# Altium project PowerBoard.PrjPcb
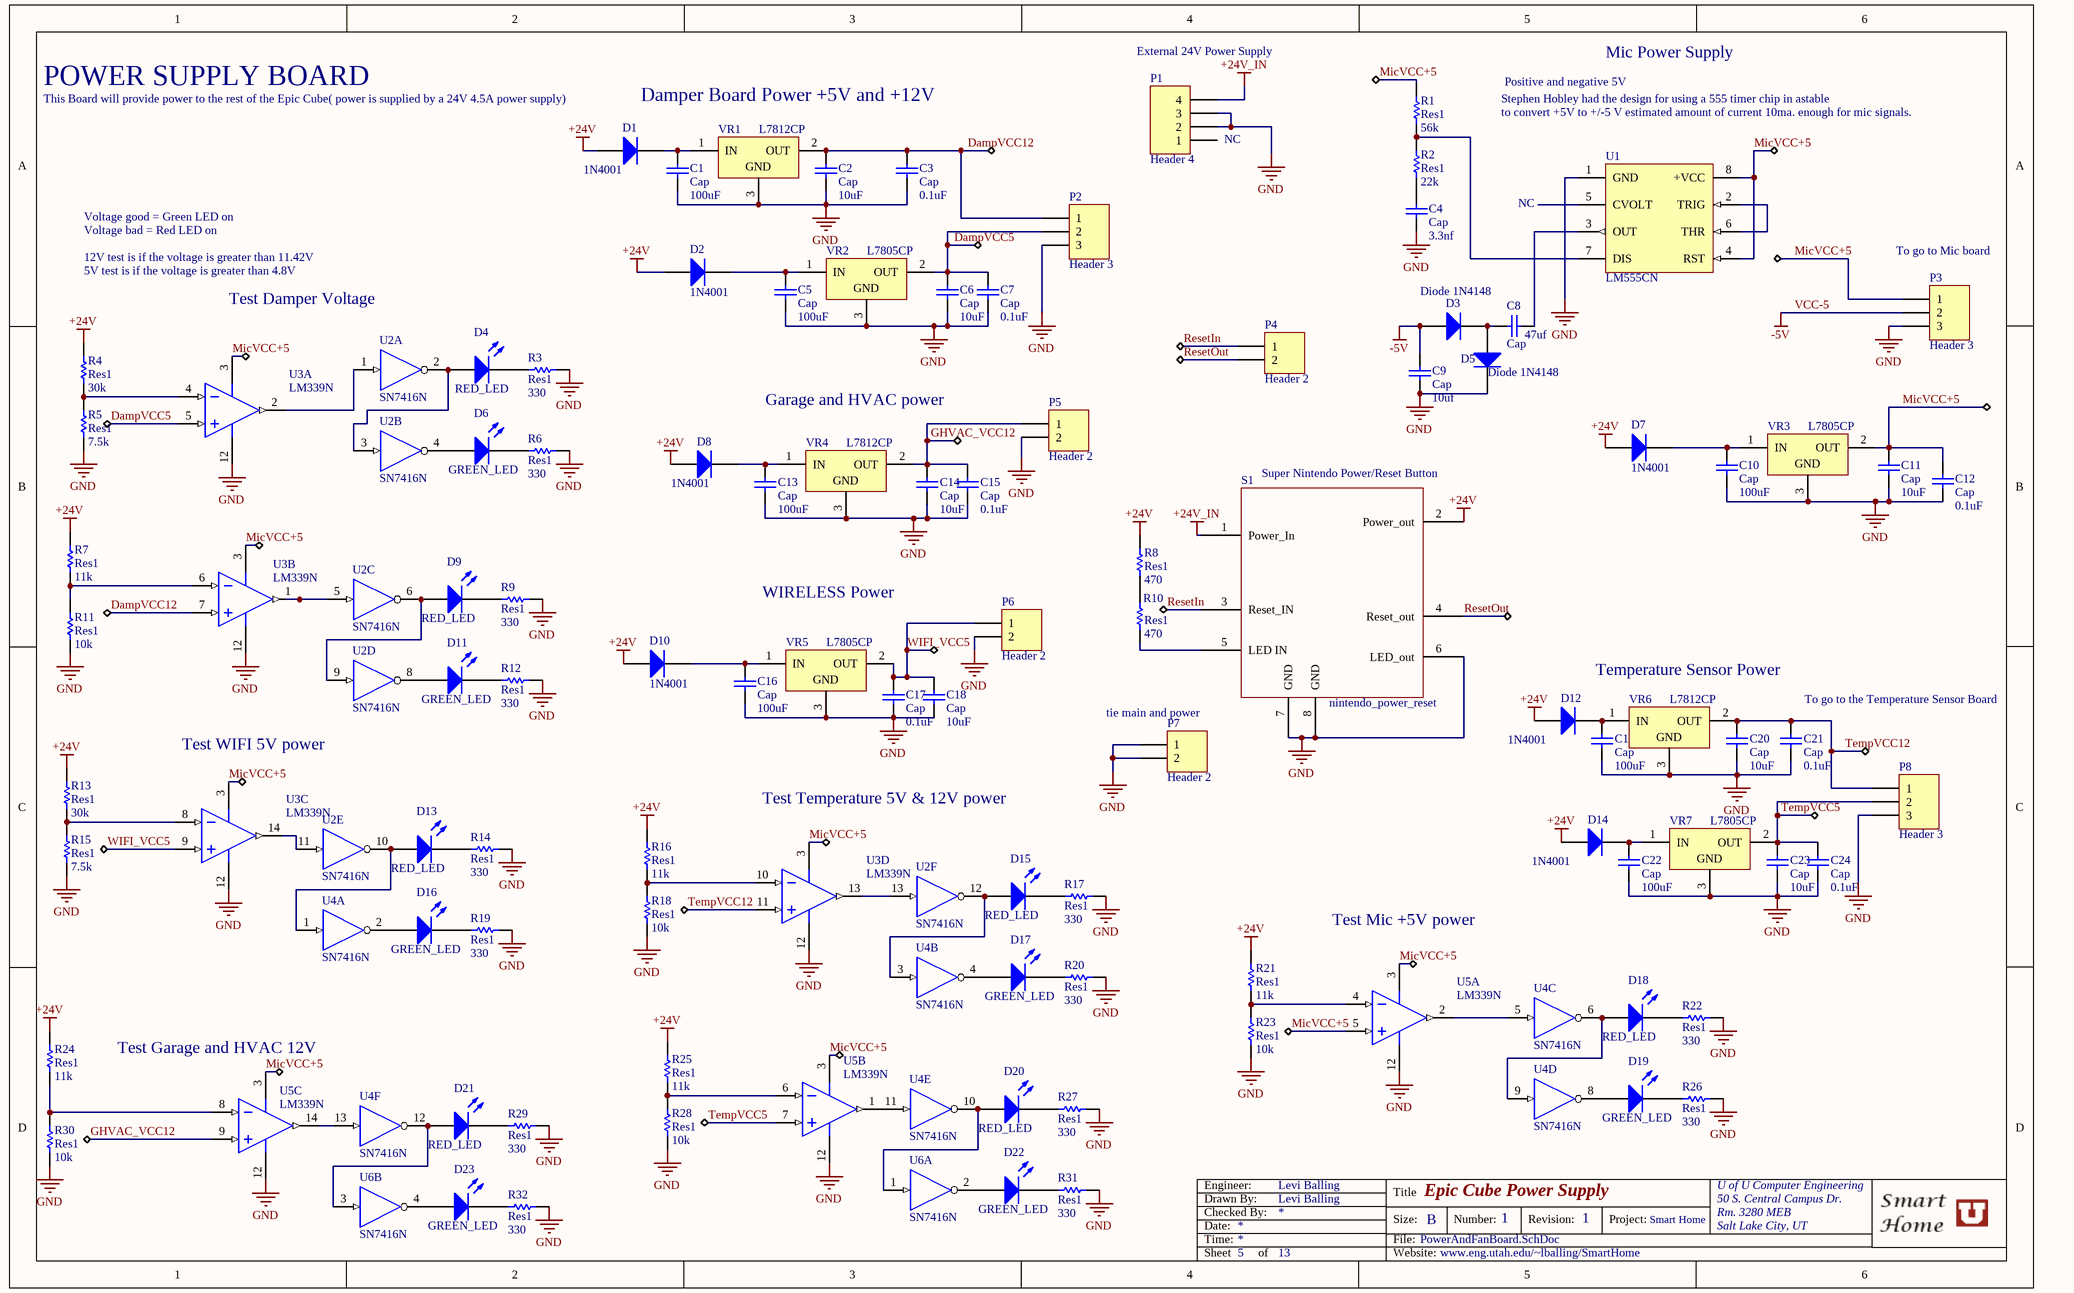
[diagram p0: PowerAndFanBoard.SchDoc]
1 sheet, 101 parts. Net scope: global (net labels, ports and power ports of the same name join across sheets).
Board file: PowerBoard.PcbDoc

## Sheet PowerAndFanBoard.SchDoc: Epic Cube Power Supply
size B; DrawnBy: Levi Balling; Engineer: Levi Balling; Organization: U of U Computer Engineering; Address1: 50 S. Central Campus Dr.; Address2: Rm. 3280 MEB; Address3: Salt Lake City, UT; Address4: Australia 2086; DocumentNumber: 1; Revision: 1; SheetNumber: 5; SheetTotal: 13; Website: www.eng.utah.edu/~lballing/SmartHome; Project: Smart Home; Description: This Board will provide power to the rest of the Epic Cube( power is supplied by a 24V 4.5A power supply); ProjectName: Smart Home

### Parts
C1  Cap  value 100uF  [RAD-0.3]
C2  Cap  value 10uF  [RAD-0.3]
C3  Cap  value 0.1uF  [RAD-0.3]
C4  Cap  value 3.3nf  [RAD-0.3]
C5  Cap  value 100uF  [RAD-0.3]
C6  Cap  value 10uF  [RAD-0.3]
C7  Cap  value 0.1uF  [RAD-0.3]
C8  Cap  value 47uf  [RAD-0.3]
C9  Cap  value 10uf  [RAD-0.3]
C10  Cap  value 100uF  [RAD-0.3]
C11  Cap  value 10uF  [RAD-0.3]
C12  Cap  value 0.1uF  [RAD-0.3]
C13  Cap  value 100uF  [RAD-0.3]
C14  Cap  value 10uF  [RAD-0.3]
C15  Cap  value 0.1uF  [RAD-0.3]
C16  Cap  value 100uF  [RAD-0.3]
C17  Cap  value 0.1uF  [RAD-0.3]
C18  Cap  value 10uF  [RAD-0.3]
C19  Cap  value 100uF  [RAD-0.3]
C20  Cap  value 10uF  [RAD-0.3]
C21  Cap  value 0.1uF  [RAD-0.3]
C22  Cap  value 100uF  [RAD-0.3]
C23  Cap  value 10uF  [RAD-0.3]
C24  Cap  value 0.1uF  [RAD-0.3]
D1  1N4001  [DO-41]
D2  1N4001  [DO-41]
D3  Diode 1N4148  [DO-35]
D4  RED_LED  [LED]
D5  Diode 1N4148  [DO-35]
D6  GREEN_LED  [LED]
D7  1N4001  [DO-41]
D8  1N4001  [DO-41]
D9  RED_LED  [LED]
D10  1N4001  [DO-41]
D11  GREEN_LED  [LED]
D12  1N4001  [DO-41]
D13  RED_LED  [LED]
D14  1N4001  [DO-41]
D15  RED_LED  [LED]
D16  GREEN_LED  [LED]
D17  GREEN_LED  [LED]
D18  RED_LED  [LED]
D19  GREEN_LED  [LED]
D20  RED_LED  [LED]
D21  RED_LED  [LED]
D22  GREEN_LED  [LED]
D23  GREEN_LED  [LED]
P1  Header 4  [MainPowerConnector]
P2  Header 3  [HDR1X3]
P3  Header 3  [HDR1X3]
P4  Header 2  [HDR1X2]
P5  Header 2  [HDR1X2]
P6  Header 2  [HDR1X2]
P7  Header 2  [HDR1X2]
P8  Header 3  [HDR1X3]
R1  Res1  value 56k  [AXIAL-0.3]
R2  Res1  value 22k  [AXIAL-0.3]
R3  Res1  value 330  [AXIAL-0.3]
R4  Res1  value 30k  [AXIAL-0.3]
R5  Res1  value 7.5k  [AXIAL-0.3]
R6  Res1  value 330  [AXIAL-0.3]
R7  Res1  value 11k  [AXIAL-0.3]
R8  Res1  value 470  [AXIAL-0.3]
R9  Res1  value 330  [AXIAL-0.3]
R10  Res1  value 470  [AXIAL-0.3]
R11  Res1  value 10k  [AXIAL-0.3]
R12  Res1  value 330  [AXIAL-0.3]
R13  Res1  value 30k  [AXIAL-0.3]
R14  Res1  value 330  [AXIAL-0.3]
R15  Res1  value 7.5k  [AXIAL-0.3]
R16  Res1  value 11k  [AXIAL-0.3]
R17  Res1  value 330  [AXIAL-0.3]
R18  Res1  value 10k  [AXIAL-0.3]
R19  Res1  value 330  [AXIAL-0.3]
R20  Res1  value 330  [AXIAL-0.3]
R21  Res1  value 11k  [AXIAL-0.3]
R22  Res1  value 330  [AXIAL-0.3]
R23  Res1  value 10k  [AXIAL-0.3]
R24  Res1  value 11k  [AXIAL-0.3]
R25  Res1  value 11k  [AXIAL-0.3]
R26  Res1  value 330  [AXIAL-0.3]
R27  Res1  value 330  [AXIAL-0.3]
R28  Res1  value 10k  [AXIAL-0.3]
R29  Res1  value 330  [AXIAL-0.3]
R30  Res1  value 10k  [AXIAL-0.3]
R31  Res1  value 330  [AXIAL-0.3]
R32  Res1  value 330  [AXIAL-0.3]
S1  nintendo_power_reset  [PCBComponent_1]
U1  LM555CN  [N08E]
U2  SN7416N  [N014]  (parts A,B,C,D,E,F of 6)
U3  LM339N  [N14A]  (parts A,B,C,D of 4)
U4  SN7416N  [N014]  (parts A,B,C,D,E,F of 6)
U5  LM339N  [N14A]  (parts A,B,C of 4)
U6  SN7416N  [N014]  (parts A,B of 6)
VR1  L7812CP  [ISOWATT220AB]
VR2  L7805CP  [ISOWATT220AB]
VR3  L7805CP  [ISOWATT220AB]
VR4  L7812CP  [ISOWATT220AB]
VR5  L7805CP  [ISOWATT220AB]
VR6  L7812CP  [ISOWATT220AB]
VR7  L7805CP  [ISOWATT220AB]

### Nets
+24V: D1.1(A) D2.1(A) D7.1(A) D8.1(A) D10.1(A) D12.1(A) D14.1(A) R4.1 R7.1 R8.1 R13.1 R16.1 R21.1 R24.1 R25.1 S1.2(Power_out)
+24V_IN: P1.4 S1.1(Power_In)
GND: C1.1 C2.1 C3.1 C4.2 C5.1 C6.1 C7.1 C9.2 C10.1 C11.1 C12.1 C13.1 C14.1 C15.1 C16.1 C17.1 C18.1 C19.1 C20.1 C21.1 C22.1 C23.1 C24.1 D5.2(K) P1.2 P1.3 P2.3 P3.3 P5.2 P6.2 P7.1 P7.2 P8.3 R3.2 R5.2 R6.2 R9.2 R11.2 R12.2 R14.2 R15.2 R17.2 R18.2 R19.2 R20.2 R22.2 R23.2 R26.2 R27.2 R28.2 R29.2 R30.2 R31.2 R32.2 S1.6(LED_out) S1.7(GND) S1.8(GND) U1.1(GND) U2.7(GND) U3.12(GND) U4.7(GND) U5.12(GND) U6.7(GND) VR1.3(GND) VR2.3(GND) VR3.3(GND) VR4.3(GND) VR5.3(GND) VR6.3(GND) VR7.3(GND)
VCC: U2.14(VCC) U4.14(VCC) U6.14(VCC)
VCC-5: C9.1 D3.1(A) P3.2  [also labelled -5V]
DampVCC5: C6.2 C7.2 P2.2 U3.5(IN1+) VR2.2(OUT)
DampVCC12: C2.2 C3.2 P2.1 U3.7(IN2+) VR1.2(OUT)
GHVAC_VCC12: C14.2 C15.2 P5.1 U5.9(IN3+) VR4.2(OUT)
MicVCC+5: C11.2 C12.2 P3.1 R1.1 U1.4(RST) U1.8(+VCC) U3.3(V+) U5.3(V+) U5.5(IN1+) VR3.2(OUT)
ResetIn: P4.1 S1.3(Reset_IN)
ResetOut: P4.2 S1.4(Reset_out)
TempVCC5: C23.2 C24.2 P8.2 U5.7(IN2+) VR7.2(OUT)
TempVCC12: C20.2 C21.2 P8.1 U3.11(IN4+) VR6.2(OUT)
WIFI_VCC5: C17.2 C18.2 P6.1 U3.9(IN3+) VR5.2(OUT)
NetC1_2: C1.2 D1.2(K) VR1.1(IN)
NetC4_1: C4.1 R2.2
NetC5_2: C5.2 D2.2(K) VR2.1(IN)
NetC8_1: C8.1 U1.3(OUT)
NetC8_2: C8.2 D3.2(K) D5.1(A)
NetC10_2: C10.2 D7.2(K) VR3.1(IN)
NetC13_2: C13.2 D8.2(K) VR4.1(IN)
NetC16_2: C16.2 D10.2(K) VR5.1(IN)
NetC19_2: C19.2 D12.2(K) VR6.1(IN)
NetC22_2: C22.2 D14.2(K) VR7.1(IN)
NetD4_1: D4.1(A) U2.2(Y) U2.3(A)
NetD4_2: D4.2(K) R3.1
NetD6_1: D6.1(A) U2.4(Y)
NetD6_2: D6.2(K) R6.1
NetD9_1: D9.1(A) U2.6(Y) U2.9(A)
NetD9_2: D9.2(K) R9.1
NetD11_1: D11.1(A) U2.8(Y)
NetD11_2: D11.2(K) R12.1
NetD13_1: D13.1(A) U2.10(Y) U4.1(A)
NetD13_2: D13.2(K) R14.1
NetD15_1: D15.1(A) U2.12(Y) U4.3(A)
NetD15_2: D15.2(K) R17.1
NetD16_1: D16.1(A) U4.2(Y)
NetD16_2: D16.2(K) R19.1
NetD17_1: D17.1(A) U4.4(Y)
NetD17_2: D17.2(K) R20.1
NetD18_1: D18.1(A) U4.6(Y) U4.9(A)
NetD18_2: D18.2(K) R22.1
NetD19_1: D19.1(A) U4.8(Y)
NetD19_2: D19.2(K) R26.1
NetD20_1: D20.1(A) U4.10(Y) U6.1(A)
NetD20_2: D20.2(K) R27.1
NetD21_1: D21.1(A) U4.12(Y) U6.3(A)
NetD21_2: D21.2(K) R29.1
NetD22_1: D22.1(A) U6.2(Y)
NetD22_2: D22.2(K) R31.1
NetD23_1: D23.1(A) U6.4(Y)
NetD23_2: D23.2(K) R32.1
NetR1_2: R1.2 R2.1 U1.7(DIS)
NetR4_2: R4.2 R5.1 U3.4(IN1-)
NetR7_2: R7.2 R11.1 U3.6(IN2-)
NetR8_2: R8.2 R10.1
NetR10_2: R10.2 S1.5(LED_IN)
NetR13_2: R13.2 R15.1 U3.8(IN3-)
NetR16_2: R16.2 R18.1 U3.10(IN4-)
NetR21_2: R21.2 R23.1 U5.4(IN1-)
NetR24_2: R24.2 R30.1 U5.8(IN3-)
NetR25_2: R25.2 R28.1 U5.6(IN2-)
NetU1_2: U1.2(TRIG) U1.6(THR)
NetU2_1: U2.1(A) U3.2(OUT1)
NetU2_5: U2.5(A) U3.1(OUT2)
NetU2_11: U2.11(A) U3.14(OUT3)
NetU2_13: U2.13(A) U3.13(OUT4)
NetU4_5: U4.5(A) U5.2(OUT1)
NetU4_11: U4.11(A) U5.1(OUT2)
NetU4_13: U4.13(A) U5.14(OUT3)

Not connected (* = marked no-connect by the designer): P1 1; U1 5(CVOLT)

### Notes on the sheet
- POWER SUPPLY BOARD
- Damper Board Power +5V and +12V
- (near P1) External 24V Power Supply
- Stephen Hobley had the design for using a 555 timer chip in astable
- Positive and negative 5V
- Mic Power Supply
- (near P1) NC
- to convert +5V to +/-5 V estimated amount of current 10ma. enough for mic signals.
- Voltage good = Green LED on
- Voltage bad = Red LED on
- NC
- 12V test is if the voltage is greater than 11.42V
- 5V test is if the voltage is greater than 4.8V
- (near P3) To go to Mic board
- Test Damper Voltage
- Garage and HVAC power
- (near S1) Super Nintendo Power/Reset Button
- WIRELESS Power
- Temperature Sensor Power
- (near C21) To go to the Temperature Sensor Board
- Test WIFI 5V power
- tie main and power
- Test Temperature 5V & 12V power
- Test Mic +5V power
- (near U5) Test Garage and HVAC 12V
- Date:
- Time:
- Engineer:
- Drawn By:
- Checked By:
- Title
- Size:
- File:
- B
- Number:
- Revision:
- Project:
- Sheet
- of
- Website:

### Library data of the parts
C1-C24 = Cap: Capacitor; Vendor: Taydaelectronics; Published: 8-Jun-2000; LatestRevisionDate: 17-Jul-2002; LatestRevisionNote: Re-released for DXP Platform.; PackageReference: RAD-0.3; Publisher: Altium Limited; PackageDescription: Radial Cap, Thru-Hole; 2 Leads; 0.3 in Pin Spacing; Price: 0.03
D1 D2 D7 D8 D10 D12 D14 = Diode 1N4001: 1 Amp General Purpose Rectifier; Vendor: Taydaelectronics; Published: 8-Jun-2000; LatestRevisionDate: 17-Jul-2002; LatestRevisionNote: Re-released for DXP Platform.; DatasheetVersion: 1998; PackageVersion: Aug-1999; PackageReference: DO-41; Publisher: Altium Limited; PackageDescription: Diode, Axial; Body 5.2 x 2.7 mm (LxDia. max), Lead Dia. 0.86 mm (max); Code_JEDEC: DO-204-AL; ComponentLink1URL: http://www.fairchildsemi.com/; ComponentLink2Description: Datasheet; ComponentLink2URL: http://www.fairchildsemi.com/ds/1N%2F1N4001.pdf; Price: 0.01; Value: 1N4001
D3 D5 = Diode 1N4148: High Conductance Fast Diode; Vendor: Taydaelectronics; Published: 8-Jun-2000; LatestRevisionDate: 17-Jul-2002; LatestRevisionNote: Re-released for DXP Platform.; DatasheetVersion: 1997; PackageReference: DO-35; Publisher: Altium Limited; PackageDescription: Diode, Axial; Body 3.8 x 1.9 mm (LxDia. max), Lead Dia. 0.53 mm (max); Code_JEDEC: DO-204-AH; ComponentLink1URL: http://www.fairchildsemi.com/; ComponentLink2Description: Datasheet; ComponentLink2URL: http://www.fairchildsemi.com/ds/1N%2F1N4148.pdf; Price: 0.01; Value: Diode 1N4148
D4 D6 D9 D11 D13 D15-D23 = LED0: Typical INFRARED GaAs LED; Vendor: Taydaelectronics; Value: LED0; Published: 8-Jun-2000; LatestRevisionDate: 08-Jul-2005; LatestRevisionNote: Mech Layer 1 removed.; PackageReference: LED-0; Publisher: Altium Limited; PackageDescription: LED; 2 Leads; Price: 0.04
P1 = Header 4: Header, 4-Pin; Vendor: Taydaelectronics; LatestRevisionDate: 17-Jul-2002; LatestRevisionNote: Re-released for DXP Platform.; Publisher: Altium Limited; Price: 0.04; Value: Header 4
P2 P3 P8 = Header 3: Header, 3-Pin; Vendor: Taydaelectronics; LatestRevisionDate: 17-Jul-2002; LatestRevisionNote: Re-released for DXP Platform.; Publisher: Altium Limited; Price: 0.03; Value: Header 3
P4-P7 = Header 2: Header, 2-Pin; Vendor: Taydaelectronics; LatestRevisionDate: 17-Jul-2002; LatestRevisionNote: Re-released for DXP Platform.; Publisher: Altium Limited; Price: 0.02; Value: Header 2
R1-R32 = Res1: Resistor; Vendor: Taydaelectronics; Published: 8-Jun-2000; LatestRevisionDate: 17-Jul-2002; LatestRevisionNote: Re-released for DXP Platform.; PackageReference: AXIAL-0.3; Publisher: Altium Limited; PackageDescription: Axial Device, Thru-Hole; 2 Leads; 0.3 in Pin Spacing; Price: 0.01
S1 = nintendo_power_reset: Vendor: All Electronics; Price: 1.0; Value: nintendo_power_reset
U1 = LM555CN: Timer; Manufacturer: National Semiconductor; CompType: Analog IC; PackageTopMarking: NSUZXYTT*LM*555CN; PowerWise: N; Vendor: Taydaelectronics; Published: 4-Dec-2008; DatasheetVersion: Jul-2006; PackageVersion: revG, May-2006; PackageReference: N08E; Publisher: Altium Limited; PackageDescription: MDIP, .365 x .250 x .130in, 8 Lead, .100in Pitch; PartNumber: LM555CN; PinCount: 8; DigiKeyPartNumber: LM555CNNS-ND; Code_JEDEC: MS-001-BA; ComponentLink1URL: http://www.national.com/ds.cgi/LM/LM555.pdf; ComponentLink2Description: LM555 Web Page; ComponentLink2URL: http://www.national.com/pf/LM/LM555.html; ComponentLink3Description: N08E package page; ComponentLink3URL: http://www.national.com/packaging/folders/n08e.html; Price: 0.14; Value: LM555CN
U2 U4 U6 = SN7416N: Hex Inverter Buffer / Driver with High-Voltage Outputs; Vendor: Taydaelectronics; Published: 8-Jun-2000; LatestRevisionDate: 04-Mar-2005; LatestRevisionNote: Stylized 3D Model Added.; DatasheetVersion: Mar-1988; PackageVersion: Oct-1995; PackageReference: N014; Publisher: Altium Limited; PackageDescription: DIP; 14 Leads; Row Spacing 7.62 mm; Pitch 2.54 mm; ComponentLink1URL: http://www.ti.com/; ComponentLink2Description: Datasheet; ComponentLink2URL: http://www-s.ti.com/sc/ds/sn5416.pdf; ComponentLink3Description: Packaging Specification; ComponentLink3URL: http://focus.ti.com/lit/ml/mpdi002c/mpdi002c.pdf; Price: 0.18; Value: SN7416N
U3 U5 = LM339N: Low Power Low Offset Voltage Quad Comparator; Manufacturer: National Semiconductor; CompType: Amplifiers; PackageTopMarking: NSUZXYYTTE#*LM339N; PowerWise: N; Vendor: Taydaelectronics; Published: 4-Dec-2008; DatasheetVersion: Mar-2004; PackageVersion: revG, May-2006; PackageReference: N14A; Publisher: Altium Limited; PackageDescription: MDIP, .750 x .250 x.130in, 14 Lead, .100in Pitch; PartNumber: LM339N; RoHS: O; PinCount: 14; DigiKeyPartNumber: LM339NNS-ND; Code_JEDEC: MS-001-AA; ComponentLink1URL: http://www.national.com/ds/LM/LM339.pdf; ComponentLink2Description: LM339 Web Page; ComponentLink2URL: http://www.national.com/pf/LM/LM339.html; ComponentLink3Description: N14A Package Page; ComponentLink3URL: http://www.national.com/packaging/folders/n14a.html; Price: 0.17; Value: LM339N
VR1-VR7 = L7805CP: Positive Voltage Regulator; Note: Tab is connected to pin 3 (GND).; Vendor: Taydaelectronics; Published: 24-Aug-2001; LatestRevisionDate: 17-Jul-2002; LatestRevisionNote: Re-released for DXP Platform.; DatasheetVersion: Dec-1998; PackageVersion: Jul-1998; PackageReference: ISOWATT220AB; Publisher: Altium Limited; PackageDescription: TO, Thru-Hole, Vertical, Heatsink Mounted; 3 In-Line Leads; Pitch 2.54 mm; Pin sequence 1, 3, 2; ComponentLink1URL: http://www.st.com/; Price: 0.24
  VR1 VR4 VR6: Value: L7812CP
  VR2 VR3 VR5 VR7: Value: L7805CP